# Altium schematic sheet fets.SchDoc: Fault-Tolerant Quadcopter
size A; DrawnBy: Vaughn Kottler; Engineer: Vaughn Kottler; Revision: A
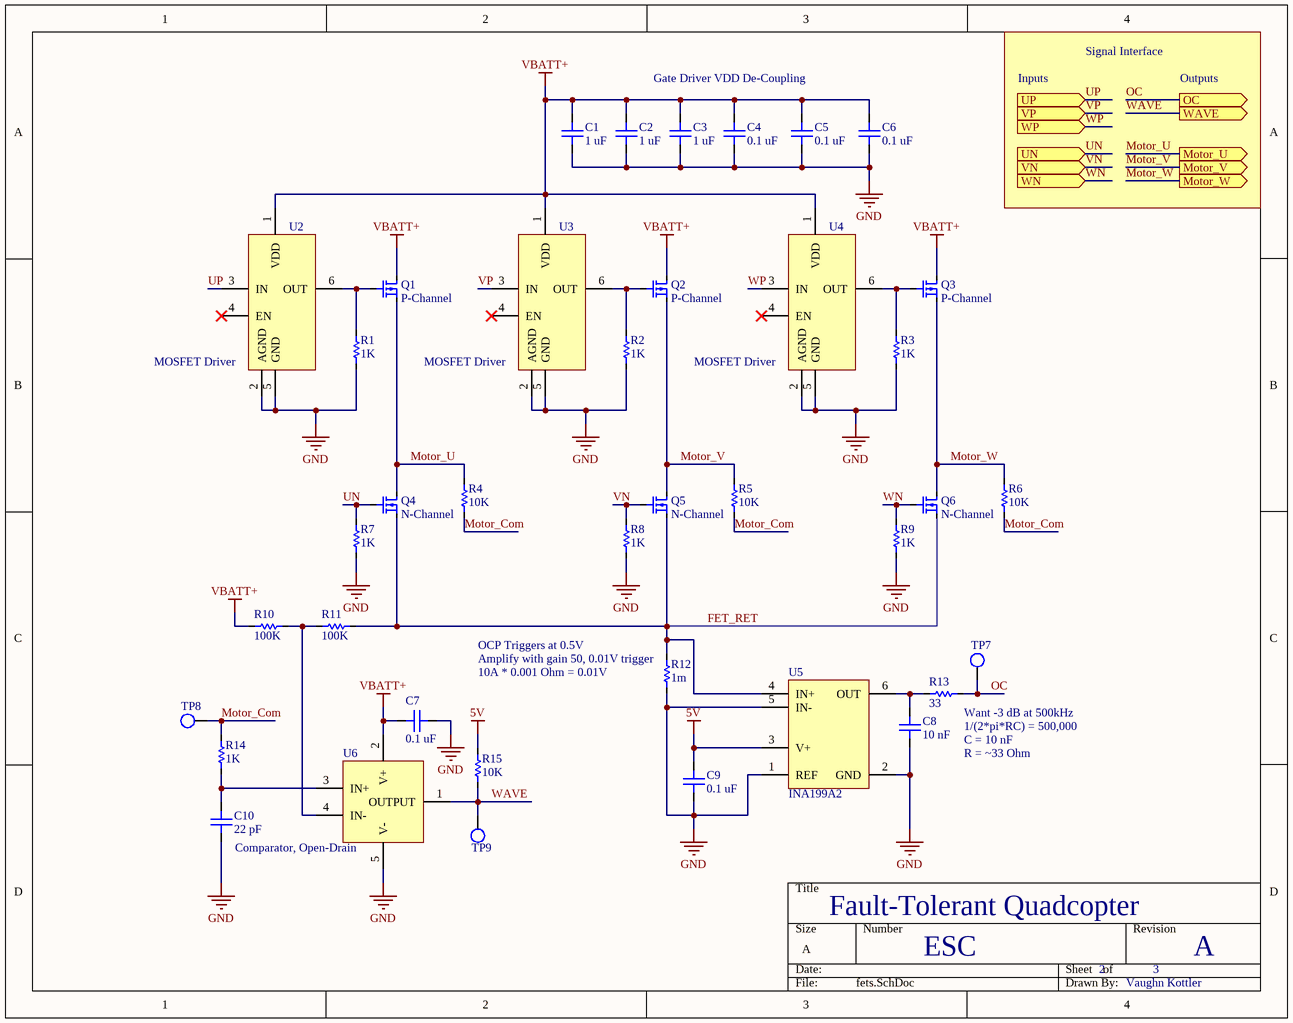
[diagram p0: fets.SchDoc]

## Parts
C1  1 uF  [CAP-CER-0805-TALL]
C2  1 uF  [CAP-CER-0805-TALL]
C3  1 uF  [CAP-CER-0805-TALL]
C4  0.1 uF  [CAP-CER-0805-SHORT]
C5  0.1 uF  [CAP-CER-0805-SHORT]
C6  0.1 uF  [CAP-CER-0805-SHORT]
C7  0.1 uF  [CAP-CER-0805-SHORT]
C8  10 nF  [CAP-CER-0805-SHORT]
C9  0.1 uF  [CAP-CER-0805-SHORT]
C10  22 pF  [CAP-CER-0805-SHORT]
Q1  P-Channel  [DPAK]
Q2  P-Channel  [DPAK]
Q3  P-Channel  [DPAK]
Q4  N-Channel  [DPAK]
Q5  N-Channel  [DPAK]
Q6  N-Channel  [DPAK]
R1  1K  [RES-0805]
R2  1K  [RES-0805]
R3  1K  [RES-0805]
R4  10K  [RES-0805]
R5  10K  [RES-0805]
R6  10K  [RES-0805]
R7  1K  [RES-0805]
R8  1K  [RES-0805]
R9  1K  [RES-0805]
R10  100K  [RES-0805]
R11  100K  [RES-0805]
R12  1m  [RES-1206]
R13  33  [RES-0805]
R14  1K  [RES-0805]
R15  10K  [RES-0805]
TP7  Test Point  [0603 Test Point]  (value not drawn)
TP8  Test Point  [0603 Test Point]  (value not drawn)
TP9  Test Point  [0603 Test Point]  (value not drawn)
U2  MOSFET Driver  [SOT-23-6]
U3  MOSFET Driver  [SOT-23-6]
U4  MOSFET Driver  [SOT-23-6]
U5  INA199A2  [SC70]
U6  Comparator, Open-Drain  [SOT-23-5]

## Ports
Motor_U (out), Motor_V (out), Motor_W (out), OC (out), UN (in), UP (in), VN (in), VP (in), WAVE (out), WN (in), WP (in)

## Nets
5V: C9.2 R15.2 U5.3(V+)
GND: C1.1 C2.1 C3.1 C4.1 C5.1 C6.1 C7.1 C8.1 C9.1 C10.1 R1.1 R2.1 R3.1 R7.1 R8.1 R9.1 R12.2 U2.2(AGND) U2.5(GND) U3.2(AGND) U3.5(GND) U4.2(AGND) U4.5(GND) U5.1(REF) U5.2(GND) U5.5(IN-) U6.5(V-)
VBATT+: C1.2 C2.2 C3.2 C4.2 C5.2 C6.2 C7.2 Q1.2(D) Q2.2(D) Q3.2(D) R10.1 U2.1(VDD) U3.1(VDD) U4.1(VDD) U6.2(V+)
FET_RET: Q4.3(S) Q5.3(S) Q6.3(S) R11.2 R12.1 U5.4(IN+)
Motor_Com: R4.1 R5.1 R6.1 R14.2 TP8.1
Motor_U: Q1.3(S) Q4.2(D) R4.2 ; port Motor_U
Motor_V: Q2.3(S) Q5.2(D) R5.2 ; port Motor_V
Motor_W: Q3.3(S) Q6.2(D) R6.2 ; port Motor_W
OC: R13.2 TP7.1 ; port OC
UN: Q4.1(G) R7.2 ; port UN
UP: U2.3(IN) ; port UP
VN: Q5.1(G) R8.2 ; port VN
VP: U3.3(IN) ; port VP
WAVE: R15.1 TP9.1 U6.1(OUTPUT) ; port WAVE
WN: Q6.1(G) R9.2 ; port WN
WP: U4.3(IN) ; port WP
NetC8_2: C8.2 R13.1 U5.6(OUT)
NetC10_2: C10.2 R14.1 U6.3(IN+)
NetQ1_1: Q1.1(G) R1.2 U2.6(OUT)
NetQ2_1: Q2.1(G) R2.2 U3.6(OUT)
NetQ3_1: Q3.1(G) R3.2 U4.6(OUT)
NetR10_2: R10.2 R11.1 U6.4(IN-)

Not connected (* = marked no-connect by the designer): U2 4(EN)*; U3 4(EN)*; U4 4(EN)*

## Notes on the sheet
- Gate Driver VDD De-Coupling
- Inputs
- Signal Interface
- Outputs
- OCP Triggers at 0.5V
- (near R12) Amplify with gain 50, 0.01V trigger
- 10A * 0.001 Ohm = 0.01V
- (near R13) Want -3 dB at 500kHz
- (near R13) 1/(2*pi*RC) = 500,000
- C = 10 nF
- R = ~33 Ohm
- ESC
- 2
- 3

## Library data of the parts
C1-C3 = CAP-CER-1uF-10V: 10%, 0805; ComponentLink1Description: Capacitor Book (Amazon); ComponentLink1URL: https://www.amazon.com/gp/product/B0728HBDRW/
C4-C7 C9 = CAP-CER-0.1uF-25V: 10%, 0805; ComponentLink1Description: Capacitor Book (Amazon); ComponentLink1URL: https://www.amazon.com/gp/product/B0728HBDRW/
C8 = CAP-CER-10nF-50V: 10%, 0805; ComponentLink1Description: Capacitor Book (Amazon); ComponentLink1URL: https://www.amazon.com/gp/product/B0728HBDRW/
C10 = CAP-CER-22pF-50V: ±5%, 0805; ComponentLink1Description: Capacitor Book (Amazon); ComponentLink1URL: https://www.amazon.com/gp/product/B0728HBDRW/
Q1-Q3 = PMOS-1.9VT-40VDS-40A: P-Channel MOSFET; Supplier 1: Digi-Key; Supplier Part Number 1: 785-1351-6-ND; ComponentLink1Description: Datasheet; ComponentLink1URL: http://aosmd.com/res/data_sheets/AOD4189.pdf
Q4-Q6 = NMOS-2.5VT-60VDS-35A: N-Channel MOSFET; Supplier 1: Digi-Key; Supplier Part Number 1: 497-7965-6-ND; ComponentLink1Description: Datasheet; ComponentLink1URL: https://www.st.com/content/ccc/resource/technical/document/datasheet/48/eb/5d/41/e2/c9/48/f2/CD00002363.pdf/files/CD00002363.pdf/jcr:content/translations/en.CD00002363.pdf
R1-R3 R7-R9 R14 = RES-1K-1/8W: 0805; ComponentLink1Description: Resistor Book (Amazon); ComponentLink1URL: https://www.amazon.com/gp/product/B071J21FYF/
R4-R6 R15 = RES-10K-1/8W: 0805; ComponentLink1Description: Resistor Book (Amazon); ComponentLink1URL: https://www.amazon.com/gp/product/B071J21FYF/
R10 R11 = RES-100K-1/8W: 0805; ComponentLink1Description: Resistor Book (Amazon); ComponentLink1URL: https://www.amazon.com/gp/product/B071J21FYF/
R12 = RES-1m-1W: 0805; Supplier 1: Digi-Key; Supplier Part Number 1: 696-1369-6-ND
R13 = RES-33-1/8W: 0805; ComponentLink1Description: Resistor Book (Amazon); ComponentLink1URL: https://www.amazon.com/gp/product/B071J21FYF/
TP7-TP9 = Test Point: 0603; Supplier 1: Digi-Key; Supplier Part Number 1: A106145DKR-ND
U2-U4 = MCP14A0052: 0.5A MOSFET Driver; Supplier 1: Digi-Key; Supplier Part Number 1: MCP14A0052T-E/CHDKR-ND; ComponentLink1Description: Datasheet; ComponentLink1URL: http://ww1.microchip.com/downloads/en/DeviceDoc/20005369A.pdf
U5 = INA199A2: 50 V/V, Current-Shunt Monitor; ComponentLink1Description: Datasheet; ComponentLink1URL: http://www.ti.com/lit/ds/symlink/ina199.pdf; Supplier 1: Digi-Key; Supplier Part Number 1: 296-27329-6-ND
U6 = LMC7221: Supplier 1: Digi-Key; ComponentLink1Description: Datasheet; ComponentLink1URL: http://www.ti.com/lit/ds/symlink/lmc7221.pdf; Supplier Part Number 1: LMC7221BIM5X/NOPBDKR-ND